# Altium schematic sheet LTEMSubsystem.SchDoc
size A3; SheetNumber: 4; SheetTotal: 14
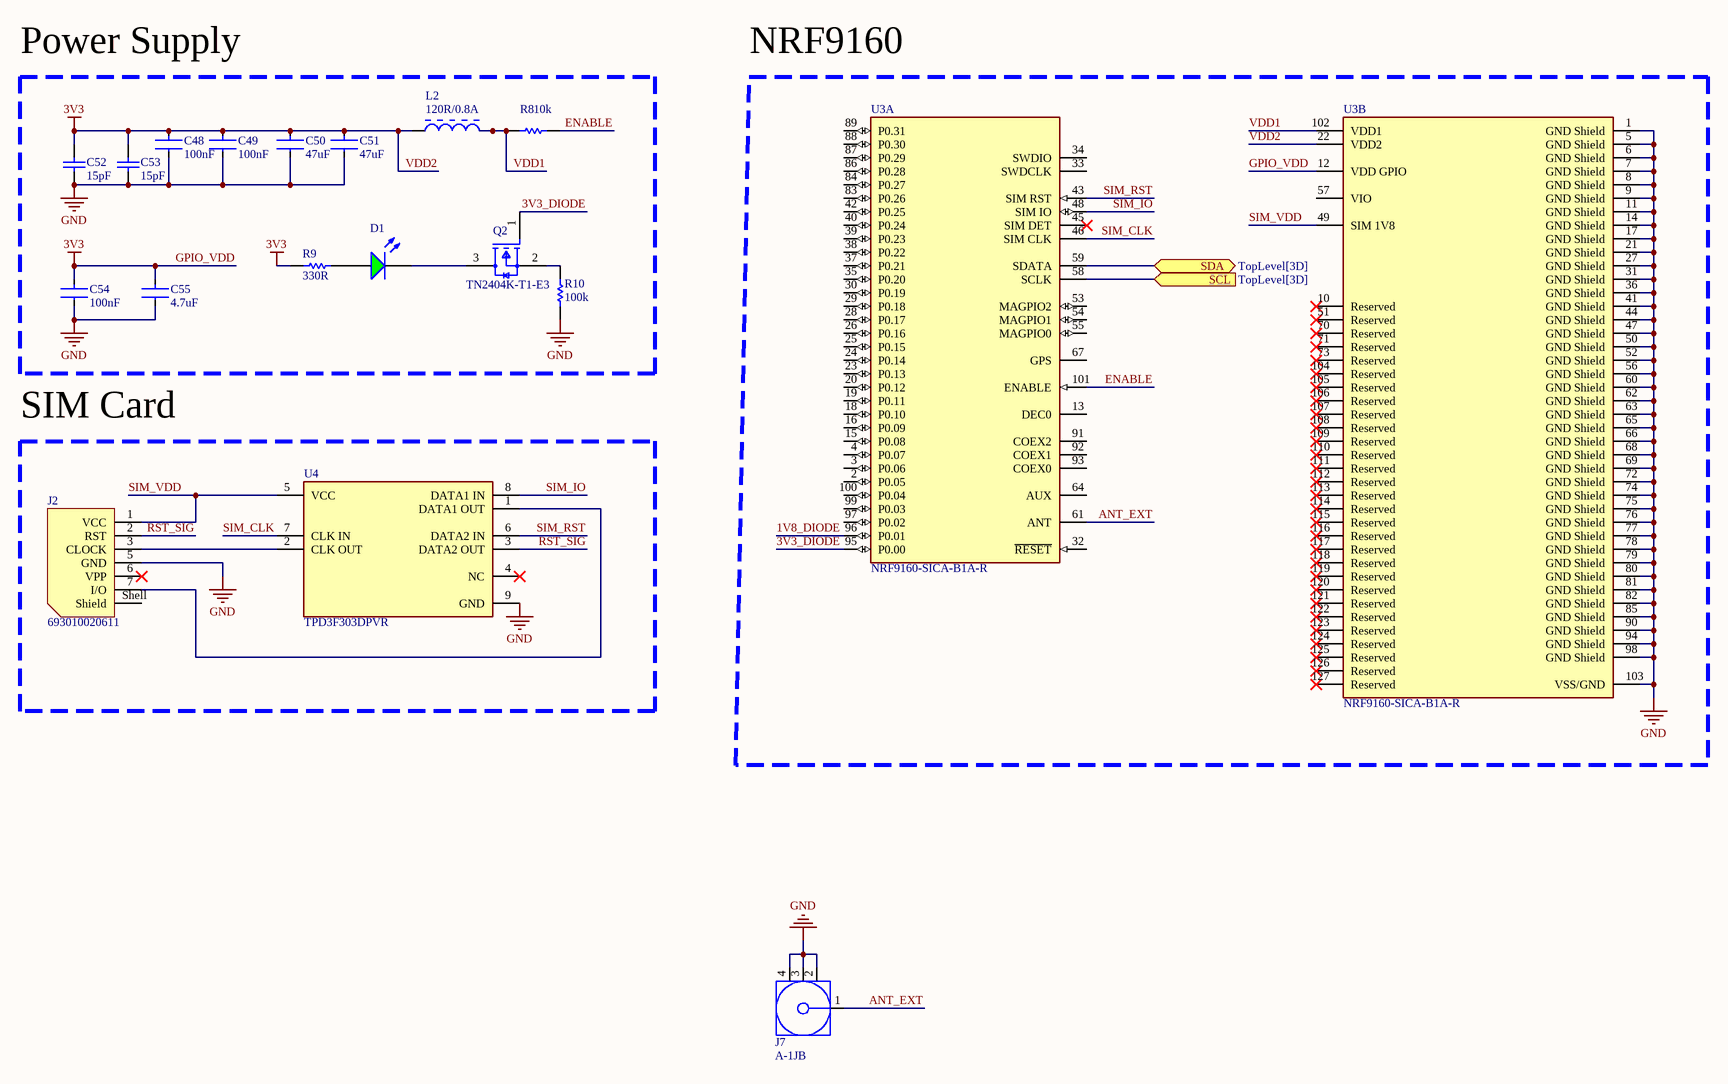
[diagram p0: LTEMSubsystem.SchDoc]

## Parts
C48  100nF  [FP-GRM033-0_03-MFG]
C49  100nF  [FP-GRM033-0_03-MFG]
C50  47uF  [FP-C3216-160-0_2-MFG]
C51  47uF  [FP-C3216-160-0_2-MFG]
C52  15pF  [CAPC1508X91X25LL25T13]
C53  15pF  [CAPC1508X91X25LL25T13]
C54  100nF  [FP-GRM033-0_03-MFG]
C55  4.7uF  [FP-C0603-CG-MFG]
D1  (no value)  [WL-SMRW_1206_cylindrical_reverse use]
J2  693010020611  [693010020611]
J7  A-1JB  [AMPH-A-1JB_V]
L2  120R/0.8A  [LIRD-LI0805H151R-10-2_V]
Q2  TN2404K-T1-E3  [FP-S-03946-MFG]
R8  10k  [RESC1609X50X30NL8T20]
R9  330R  [RESC1005X40X25ML05T05]
R10  100k  [RESC1005X40X25NL10T10]
U3  NRF9160-SICA-B1A-R  [FP-NRF9160-SICA-B1A-R-MFG]  (parts A,B of 2)
U4  TPD3F303DPVR  [FP-DPV0008A-IPC_C]

## Blocks framed on the sheet
Power Supply: C48-C55 D1 L2 Q2 R8-R10
NRF9160: U3
SIM Card: J2 U4

## Ports
SCL (in, see TopLevel[3D]), SDA (bidir, see TopLevel[3D])

## Nets
GND: C48.2 C49.2 C50.2 C51.2 C52.1 C53.1 C54.2 C55.2 J2.5(GND) J7.2 J7.3 J7.4 R10.2 U3.1(GND_Shield) U3.5(GND_Shield) U3.6(GND_Shield) U3.7(GND_Shield) U3.8(GND_Shield) U3.9(GND_Shield) U3.11(GND_Shield) U3.14(GND_Shield) U3.17(GND_Shield) U3.21(GND_Shield) U3.27(GND_Shield) U3.31(GND_Shield) U3.36(GND_Shield) U3.41(GND_Shield) U3.44(GND_Shield) U3.47(GND_Shield) U3.50(GND_Shield) U3.52(GND_Shield) U3.56(GND_Shield) U3.60(GND_Shield) U3.62(GND_Shield) U3.63(GND_Shield) U3.65(GND_Shield) U3.66(GND_Shield) U3.68(GND_Shield) U3.69(GND_Shield) U3.72(GND_Shield) U3.74(GND_Shield) U3.75(GND_Shield) U3.76(GND_Shield) U3.77(GND_Shield) U3.78(GND_Shield) U3.79(GND_Shield) U3.80(GND_Shield) U3.81(GND_Shield) U3.82(GND_Shield) U3.85(GND_Shield) U3.90(GND_Shield) U3.94(GND_Shield) U3.98(GND_Shield) U3.103(VSS/GND) U4.9(GND)
GPIO_VDD: C48.1 C49.1 C50.1 C51.1 C52.2 C53.2 C54.1 C55.1 L2.1 R9.1 U3.12(VDD_GPIO) U3.22(VDD2)  [also labelled 3V3, VDD2]
1V8_DIODE: U3.96(P0.01)
3V3_DIODE: Q2.1(G) U3.95(P0.00)
ANT_EXT: J7.1 U3.61(ANT)
ENABLE: R8.2 U3.101(ENABLE)
RST_SIG: J2.2(RST) U4.3(DATA2_OUT)
SCL: U3.58(SCLK) ; port SCL
SDA: U3.59(SDATA) ; port SDA
SIM_CLK: U3.46(SIM_CLK) U4.7(CLK_IN)
SIM_IO: U3.48(SIM_IO) U4.8(DATA1_IN)
SIM_RST: U3.43(SIM_RST) U4.6(DATA2_IN)
SIM_VDD: J2.1(VCC) U3.49(SIM_1V8) U4.5(VCC)
VDD1: L2.2 R8.1 U3.102(VDD1)
NetD1_1: D1.1(K) Q2.3(D)
NetD1_2: D1.2(A) R9.2
NetJ2_3: J2.3(CLOCK) U4.2(CLK_OUT)
NetJ2_7: J2.7(I/O) U4.1(DATA1_OUT)
NetQ2_2: Q2.2(S) R10.1

Not connected (* = marked no-connect by the designer): J2 6(VPP)* Shell(Shield); U3 2(P0.05) 3(P0.06) 4(P0.07) 10(Reserved)* 13(DEC0) 15(P0.08) 16(P0.09) 18(P0.10) 19(P0.11) 20(P0.12) 23(P0.13) 24(P0.14) 25(P0.15) 26(P0.16) 28(P0.17) 29(P0.18) 30(P0.19) 32(~{RESET}) 33(SWDCLK) 34(SWDIO) 35(P0.20) 37(P0.21) 38(P0.22) 39(P0.23) 40(P0.24) 42(P0.25) 45(SIM_DET)* 51(Reserved)* 53(MAGPIO2) 54(MAGPIO1) 55(MAGPIO0) 57(VIO) 64(AUX) 67(GPS) 70(Reserved)* 71(Reserved)* 73(Reserved)* 83(P0.26) 84(P0.27) 86(P0.28) 87(P0.29) 88(P0.30) 89(P0.31) 91(COEX2) 92(COEX1) 93(COEX0) 97(P0.02) 99(P0.03) 100(P0.04) 104(Reserved)* 105(Reserved)* 106(Reserved)* 107(Reserved)* 108(Reserved)* 109(Reserved)* 110(Reserved)* 111(Reserved)* 112(Reserved)* 113(Reserved)* 114(Reserved)* 115(Reserved)* 116(Reserved)* 117(Reserved)* 118(Reserved)* 119(Reserved)* 120(Reserved)* 121(Reserved)* 122(Reserved)* 123(Reserved)* 124(Reserved)* 125(Reserved)* 126(Reserved)* 127(Reserved)*; U4 4(NC)*

## Library data of the parts
C48 C49 C54 = CMP-06035-000062-2: GRM033R60J104KE19D; Dielectric: X5R; Voltage Rating (DC): 6.3V; Material: Ceramic; Tolerance: 10%; Min Operating Temperature: -55°C; Lead Free: Lead Free; Radiation Hardening: No; REACH SVHC: No SVHC; Case/Package: 0201; Voltage Rating: 6.3V; Length: 0.6mm; Max Operating Temperature: 85°C; Width: 0.012inch; Depth: 0.3mm; Case Code (Metric): 0603; Thickness: 0.013inch; Packaging: Tape and Reel; Height: 0.3mm; Capacitance: 100nF; Weight: 6E-06oz; Package Quantity: 1; Mount: Surface Mount; Voltage: 6.3V; Case Code (Imperial): 0201; Termination: SMD/SMT
C50 C51 = CMP-2000-07442-2: C3216X5R1C476M160AB; Dielectric: X5R; Dielectric Material: Ceramic; Tolerance: 20%; Voltage Rating (DC): 16V; Resistor Type: Ceramic; Width: 0.063inch; Case Code (Imperial): 1206; Radiation Hardening: No; Thickness: 0.071inch; Weight: 0.000571oz; Termination: SMD/SMT; Min Operating Temperature: -55°C; Depth: 1.6mm; Case Code (Metric): 3216; Max Operating Temperature: 85°C; RoHS Compliant: Yes; REACH SVHC: No SVHC; Mount: Surface Mount; Lead Free: Lead Free; Height: 1.6mm; Length: 3.2mm; Capacitance: 47uF; Package Quantity: 1; Construction: Flat; Packaging: Tape and Reel; Series: C; Case/Package: 1206; Voltage Rating: 16V
C52 C53 = CMP-2006-04659-1: 06032U150GAT2A; Manufacturer: AVX Interconnect / Elco; Part Number: 06032U150GAT2A
C55 = CMP-2006-02256-2: C0603C475K9PACTU; Manufacturer: Kemet; Temperature Coefficient: 15%; Tolerance: 10%; Voltage Rating: 6.3V; Material: Ceramic; Temperature Characteristic: X5R; Device Class L3: Ceramic Capacitors; RoHS: TRUE; Value: 4.7uF; Lead Free: Yes; ComponentLink2Description: Datasheet; Mouser Description: Multilayer Ceramic Capacitors MLCC - SMD/SMT 6.3volts 4.7uF X5R 10%; Package: C0603-CG; Digikey Description: CAP CER 4.7UF 6.3V X5R 0603; ComponentLink2URL: https://content.kemet.com/datasheets/KEM_C1006_X5R_SMD.pdf; Category: Cap; Temperature Range Low: -55°C; Capacitance: 4.7uF; Temperature: -55°C to +85°C; Octopart: https://octopart.com/c0603c475k9pactu-kemet-104242; Ipc Land Pattern Name: CAPC16080X80; Temperature Range High: +85°C; Height: 0.9mm; Device Class L1: Passive Components; Manufacturer Part Number: C0603C475K9PACTU; Automotive: No; Device Class L2: Capacitors
D1 = CMP-1428-00004-3: 156120GS75300; NexarPartId: 29717826; Reverse Voltage: 5V; Forward Current: 100mA; Luminous Intensity: 235mcd; Lens Style: Cylindrical; Power Dissipation: 95mW; Test Current: 20mA; Forward Voltage: 3.3V; Peak Wavelength: 520nm; Wavelength: 525nm; Viewing Angle: 140°; Color: Green; Case Code (Metric): 3216; Height: 1.2mm; RoHS: Compliant; Packaging: Tape and Reel; Width: 1.6mm; Lead Free: Lead Free; Case/Package: 1206; Length: 3.2mm; Max Operating Temperature: 85°C; REACH SVHC: Unknown; Dominant Wavelength: 525nm; Min Operating Temperature: -40°C; Mount: Surface Mount; Case Code (Imperial): 1206; Max Reverse Voltage (DC): 5V
J2 = CMP-1502-00155-2: NexarPartId: 22862857; Connector Type: Connector, Socket; Operating Supply Voltage: 50V; Insulation Resistance: 500MΩ; Number of Contacts: 6; Current Rating: 500mA; Max Operating Temperature: 85°C; Number of Pins: 6; Min Operating Temperature: -25°C; Mount: Surface Mount; Contact Material: Copper; REACH SVHC: Unknown; Packaging: Tape and Reel; Length: 16.4mm; Width: 16.3mm; RoHS: Compliant; Height: 1.8mm; Number of Positions: 6; Contact Plating: Gold
J7 = CMP-1743-00001-1: AMC PCB Jack, 0 to 60 GHz, 60 V, -40 to 90 degC, 4-Pin SMD, RoHS, Tape and Reel; Capacitance: 100 uF; Case\Package: 2917; Voltage Rating (DC): 10 V; ESR: 700 mohm; Tolerance: 10%; ComponentLink1Description: Datasheet; PackageDescription: 4-Pin Surface Mount Device, Body 2.6 x 2.6 mm; Radiation Hardening: No; Package Quantity: 1; REACH SVHC: No SVHC; DatasheetVersion: Rev. K, 05/2016; ComponentLink1URL: http://drawings.amphenolrf.com/Customer_Outline/CA-1JB.pdf; Pins: 2; Packaging: Tape and Reel; Min Operating Temperature: -55 degC; RoHSCompliant: true; Length: 7.3 mm; PackageReference: A-1JB; Weight: 0.023634 oz; Mount: Surface Mount; Voltage Rating: 10 V; Max Operating Temperature: 125 degC; Height: 3.1 mm; Case Code (Imperial): 2917; Case Code (Metric): 7343; Width: 4.3 mm
L2 = CMP-2000-06542-1: LI0805H121R-10; Manufacturer: Laird; Package Version: Rev. D, 08/2013; Impedance @ Frequency: 120Ohm@100MHz; Other Names: 240-2383-1; Kits: 240-2227-ND-KITEMIFERRITEBEADCHIPSMD; DC Resistance (DCR) (Max): 150mOhm; Online Catalog: LISeries; Filter Type: SignalLine; Number of Lines: 1; Catalog Drawings: (HI,HZ,LI,MI)0805Series_1.10mmMax.Height; Current Rating (Max): 800mA; Category: Filters; Size / Dimension: 0.079"Lx0.049"W(2.00mmx1.25mm); Operating Temperature: -40°C~125°C; Datasheet Version: Rev. E, 08/2013; Datasheet URL: http://cdn.lairdtech.com/home/brandworld/files/LI0805H121R-10.pdf; Package Description: 2-Pin Surface Mount Device, Body 2 x 1.25 mm; Package Reference: LI0805H15R-10-2; Mounting Type: SurfaceMount; Package / Case: 0805(2012Metric); Series: LI; Package URL: http://cdn.lairdtech.com/home/brandworld/files/LI0805H151R-10.pdf; Ratings: -; Manufacturer URL: https://www.lairdtech.com/; Family: FerriteBeadsandChips; Height (Max): 0.043"(1.10mm); Standard Package: 1; Mounting Technology: SurfaceMount; Packaging: CutTape(CT)
Q2 = CMP-00030-39730086-1: TN2404K-T1-E3 Single N-Channel 240 V 4 Ohms Surface Mount Power Mosfet - SOT-23; Number of Elements: 1; Drain to Source Breakdown Voltage: 240V; Nominal Vgs: 800mV; Max Junction Temperature (Tj): 150°C; Turn-Off Delay Time: 35ns; Max Power Dissipation: 360mW; Rds On Max: 4Ω; Drain to Source Resistance: 2.2Ω; Turn-On Delay Time: 5ns; Rise Time: 12ns; Continuous Drain Current (ID): 200mA; Gate to Source Voltage (Vgs): 20V; Number of Pins: 3; Contact Plating: Tin; Length: 3.04mm; Lead Free: Lead Free; Mount: Surface Mount; Weight: 1.437803g; Number of Channels: 1; Height: 1.02mm; Max Operating Temperature: 150°C; Min Operating Temperature: -55°C; Case/Package: SOT-23-3; Width: 1.4mm; Radiation Hardening: No; Resistance: 4Ω; Schedule B: 8541210080, 8541210080; Power Dissipation: 360mW; Drain to Source Voltage (Vdss): 240V; Fall Time: 12ns; Element Configuration: Single; RoHS: Compliant; NexarPartId: 39730086; Threshold Voltage: 800mV; REACH SVHC: Unknown
R8 = CMP-1666-00005-4: CRCW060310K0FKEA; Manufacturer: Vishay Semiconductor; Voltage Rating: 75 V; Max Operating Temperature: 155 degC; PackageDescription: 2-Pin Surface Mount Device, Body 1.575 x 0.85 mm; ComponentLink1Description: Manufacturer URL; RoHSCompliant: true; PackageReference: 0603; REACH SVHC: Unknown; Length: 1.55 mm; DatasheetVersion: 06/2012; Packaging: Tape and Reel; Min Operating Temperature: -55 degC; Mounting Technology: Surface Mount; ComponentLink2URL: https://datasheet.ciiva.com/11809/0900766b80d98afc-11809037.pdf; Height: 0.45 mm; ComponentLink2Description: Datasheet; Package Quantity: 5000; ComponentLink1URL: http://www.vishay.com/
R9 = CMP-2002-01143-1: ERJ2RKF3300X; Manufacturer: Panasonic; Part Number: ERJ2RKF3300X
R10 = CMP-2002-05837-1: ERA-2AED104X; Manufacturer: Panasonic; Part Number: ERA-2AED104X
U3 = CMP-03900-112853535-1: NRF9160-SICA-B1A-R LTE-M/NB-IoT/GPS Module 700MHz to 2200MHz 3.3V to 5.5V LGA; Min Supply Voltage: 3V; Number of ADC Channels: 8; Bandwidth: 1.5GHz; Data Rate: 8Mbps; Interface: I2C, I2S, SPI, UART; Max Frequency: 2.2GHz; Number of GPIO: 32; Max Supply Voltage: 5.5V; Ambient Temperature Range High: 85°C; Max Operating Temperature: 85°C; NexarPartId: 112853535; Min Operating Temperature: -40°C; Height: 1.1mm
U4 = CMP-0326-00035-4: FILTER RC(PI) ESD SMD; Number of Channels: 3; Frequency: 308MHz; Capacitance: 20pF; Operating Supply Voltage: 5.5V; Clamping Voltage: 10V; ESD Protection: Yes; Contact Plating: Gold; Lead Free: Lead Free; REACH SVHC: No SVHC; Radiation Hardening: No; Width: 0.063inch; Height: 0.026inch; Number of Pins: 8; Depth: 1.7mm; RoHS Compliant: Yes; Case/Package: SMD/SMT; Termination: Flat; Length: 2.2mm; Min Operating Temperature: -40°C; Series: TPD3F303; Operating Frequency: 308MHz; Packaging: Tape and Reel; Max Operating Temperature: 85°C; Package Quantity: 1